# Altium project MotorDriver.PrjPcb
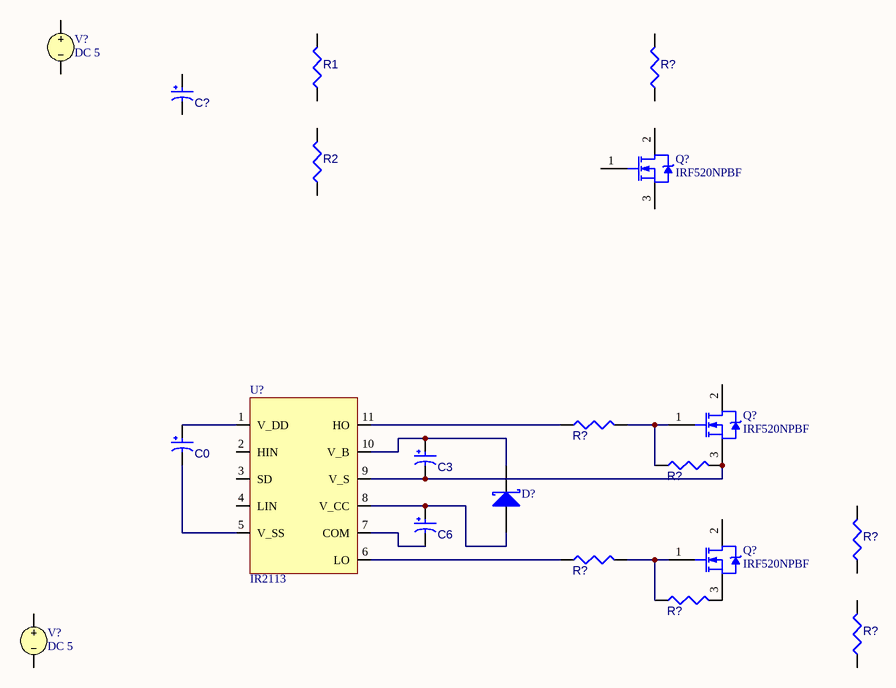
[diagram p0: Full Driver.SchDoc]
1 sheet, 20 parts. Net scope: global (net labels, ports and power ports of the same name join across sheets).
Board file: PCB1.PcbDoc

## Sheet Full Driver.SchDoc: alpha
size A; DrawnBy: Cesar Leon; SheetNumber: 1; SheetTotal: 1

### Parts
(Parts that share a designator on the sheet are numbered #1, #2 ... from top to bottom, then left to right.)
C0  ECA-2AM220  [CAPPR55-250-1120X630X1220]  (value not drawn)
C3  ECA-2AM220  [CAPPR55-250-1120X630X1220]  (value not drawn)
C6  ECA-2AM220  [CAPPR55-250-1120X630X1220]  (value not drawn)
C?  ECA-2AM220  [CAPPR55-250-1120X630X1220]  (value not drawn)
D?  Schottky Diode  (value not drawn)
Q?#1  IRF520NPBF  [INTR-TO-220AB-3]
Q?#2  IRF520NPBF  [INTR-TO-220AB-3]
Q?#3  IRF520NPBF  [INTR-TO-220AB-3]
R1  resistor  [RESC0402(1005)_L]  (value not drawn)
R2  resistor  [RESC0402(1005)_L]  (value not drawn)
R?#1  resistor  [RESC0402(1005)_L]  (value not drawn)
R?#2  resistor  [RESC0402(1005)_L]  (value not drawn)
R?#3  resistor  [RESC0402(1005)_L]  (value not drawn)
R?#4  resistor  [RESC0402(1005)_L]  (value not drawn)
R?#5  resistor  [RESC0402(1005)_L]  (value not drawn)
R?#6  resistor  [RESC0402(1005)_L]  (value not drawn)
R?#7  resistor  [RESC0402(1005)_L]  (value not drawn)
U?  IR2113
V?#1  DC 5
V?#2  DC 5

### Nets
NetC0_1: C0.1 U?.1(V_DD)
NetC0_2: C0.2 U?.5(V_SS)
NetC3_1: C3.1 D?.2(K) U?.10(V_B)
NetC3_2: C3.2 Q?#2.3(S) R?#3.2 U?.9(V_S)
NetC6_1: C6.1 D?.1(A) U?.8(V_CC)
NetC6_2: C6.2 U?.7(COM)
NetQ?#2_1: Q?#2.1(G) R?#2.2 R?#3.1
NetQ?#3_1: Q?#3.1(G) R?#4.2 R?#6.1
NetQ?#3_3: Q?#3.3(S) R?#6.2
NetR?#2_1: R?#2.1 U?.11(HO)
NetR?#4_1: R?#4.1 U?.6(LO)

Not connected (* = marked no-connect by the designer): C? 1 2; Q?#1 1(G) 2(D) 3(S); Q?#2 2(D); Q?#3 2(D); R1 1 2; R2 1 2; R?#1 1 2; R?#5 1 2; R?#7 1 2; U? 2(HIN) 3(SD) 4(LIN); V?#1 1 2; V?#2 1 2

### Library data of the parts
C0 C3 C6 C? = CAP-P-2: Aluminum Electrolytic Capacitor, 22 uF, +/- 20%, 100 V, -40 to 85 degC, 2-Pin THD, RoHS, Bulk; Manufacturer: Panasonic; Voltage Rating: 100V; Ripple Current: 115mA; Value: 22µF; Manufacturer URL: http://www.panasonic.com/; Packaging: Bulk; Package Description: 2-Pin Radial Lead, Dia 6.3 mm, Height 12.2 mm; Datasheet URL: https://industrial.panasonic.com/cdbs/www-data/pdf/RDF0000/ABA0000C1047.pdf; RoHS Compliant: True; Package Quantity: 200; Case/Package: Radial; Package Reference: CAPPR55-250-1120X630X1220; Datasheet Version: Mar-16; Pins: 2; Tolerance: 20%; Diameter: 6.3mm; Max Operating Temperature: 85°C; Ripple Current (AC): 115mA; Capacitor Type: Electrolytic; Mounting Technology: TH; Min Operating Temperature: -40°C; Lead Pitch: 2.5mm
D? = Schottky Diode: AF: 1; BV: 0; BV_MAX: 1e99; EG: 1.11; FC: 0.5; IBV: 0.001; IS: 1e-14; MJSW: 0.33; NTUN: 30; TNOM: 27; XTI: 3; SimulationGenericComponent: True; CJO: 0; CJP: 0; CTA: 0; CTP: 0; FCS: 0.5; FV_MAX: 1e99; IKF: 0; IKR: 0; ISR: 1e-14; JSW: 0; JTUN: 0; JTUNSW: 0; KEG: 1; KF: 0; LEVEL: 1; N: 1; NBV: 1; NR: 1; NS: 1; PHP: 1; RS: 0; TCV: 0; TLEV: 0; TLEVC: 0; TM1: 0; TM2: 0; TPB: 0; TPHP: 0; TRS: 0; TRS2: 0; TT: 0; TTT1: 0; TTT2: 0; VJ: 1; XTITUN: 3
Q?#1-Q?#3 = CMP-013-00017-4: HEXFET(R) Power MOSFET, 100 V, 9.7 A, 0.2 Ohm, -55 to 175 degC, 3-Pin FM (TO-220AB), RoHS, Tube; Manufacturer: International Rectifier; Power: 48W; Elements: 1; Typical Rise Time: 23ns; Nominal Dual Supply Voltage: 100V; Rds On Max: 200mohm; Input Capacitance: 330pF; Nominal Vgs: 4V; Package Reference: TO-220AB; Max Operating Temperature: 175°C; Datasheet Version: Nov-03; Datasheet URL: http://www.infineon.com/dgdl/irf520npbf.pdf?fileId=5546d462533600a4015355e340711985; Package Quantity: 50; Package Description: 3-Pin Flange Mount, Body 4.445 x 10.415 mm, Pitch 2.54 mm; Pins: 3; Packaging: Rail/Tube; RoHS Compliant: True; Min Operating Temperature: -55°C; Case/Package: TO-220-3; Mounting Technology: TH
R1 R2 R?#1-R?#7 = resistor: 200R 0.063W 5% 0402 (1005 Metric)  SMD; Value: 200.00 Ohm; Case-EIA: 0402; Case-Metric: 1005; Technology: SMT; Power: 0.063 W; Tolerance: 5 %
U? = GDriver_IR2113: High and low side gate driver.
V?#1 V?#2 = VSRC: Voltage Source; Note: PCB Footprint - Not required; AC Magnitude: 1; AC Phase: 0; Value: 5; Published: 8-Jun-2000; LatestRevisionDate: 17-Jul-2002; LatestRevisionNote: Re-released for DXP Platform.; PackageReference: Not Applicable; Publisher: Altium Limited